# EAGLE design 15321^1 (EAGLE 7.6.0)
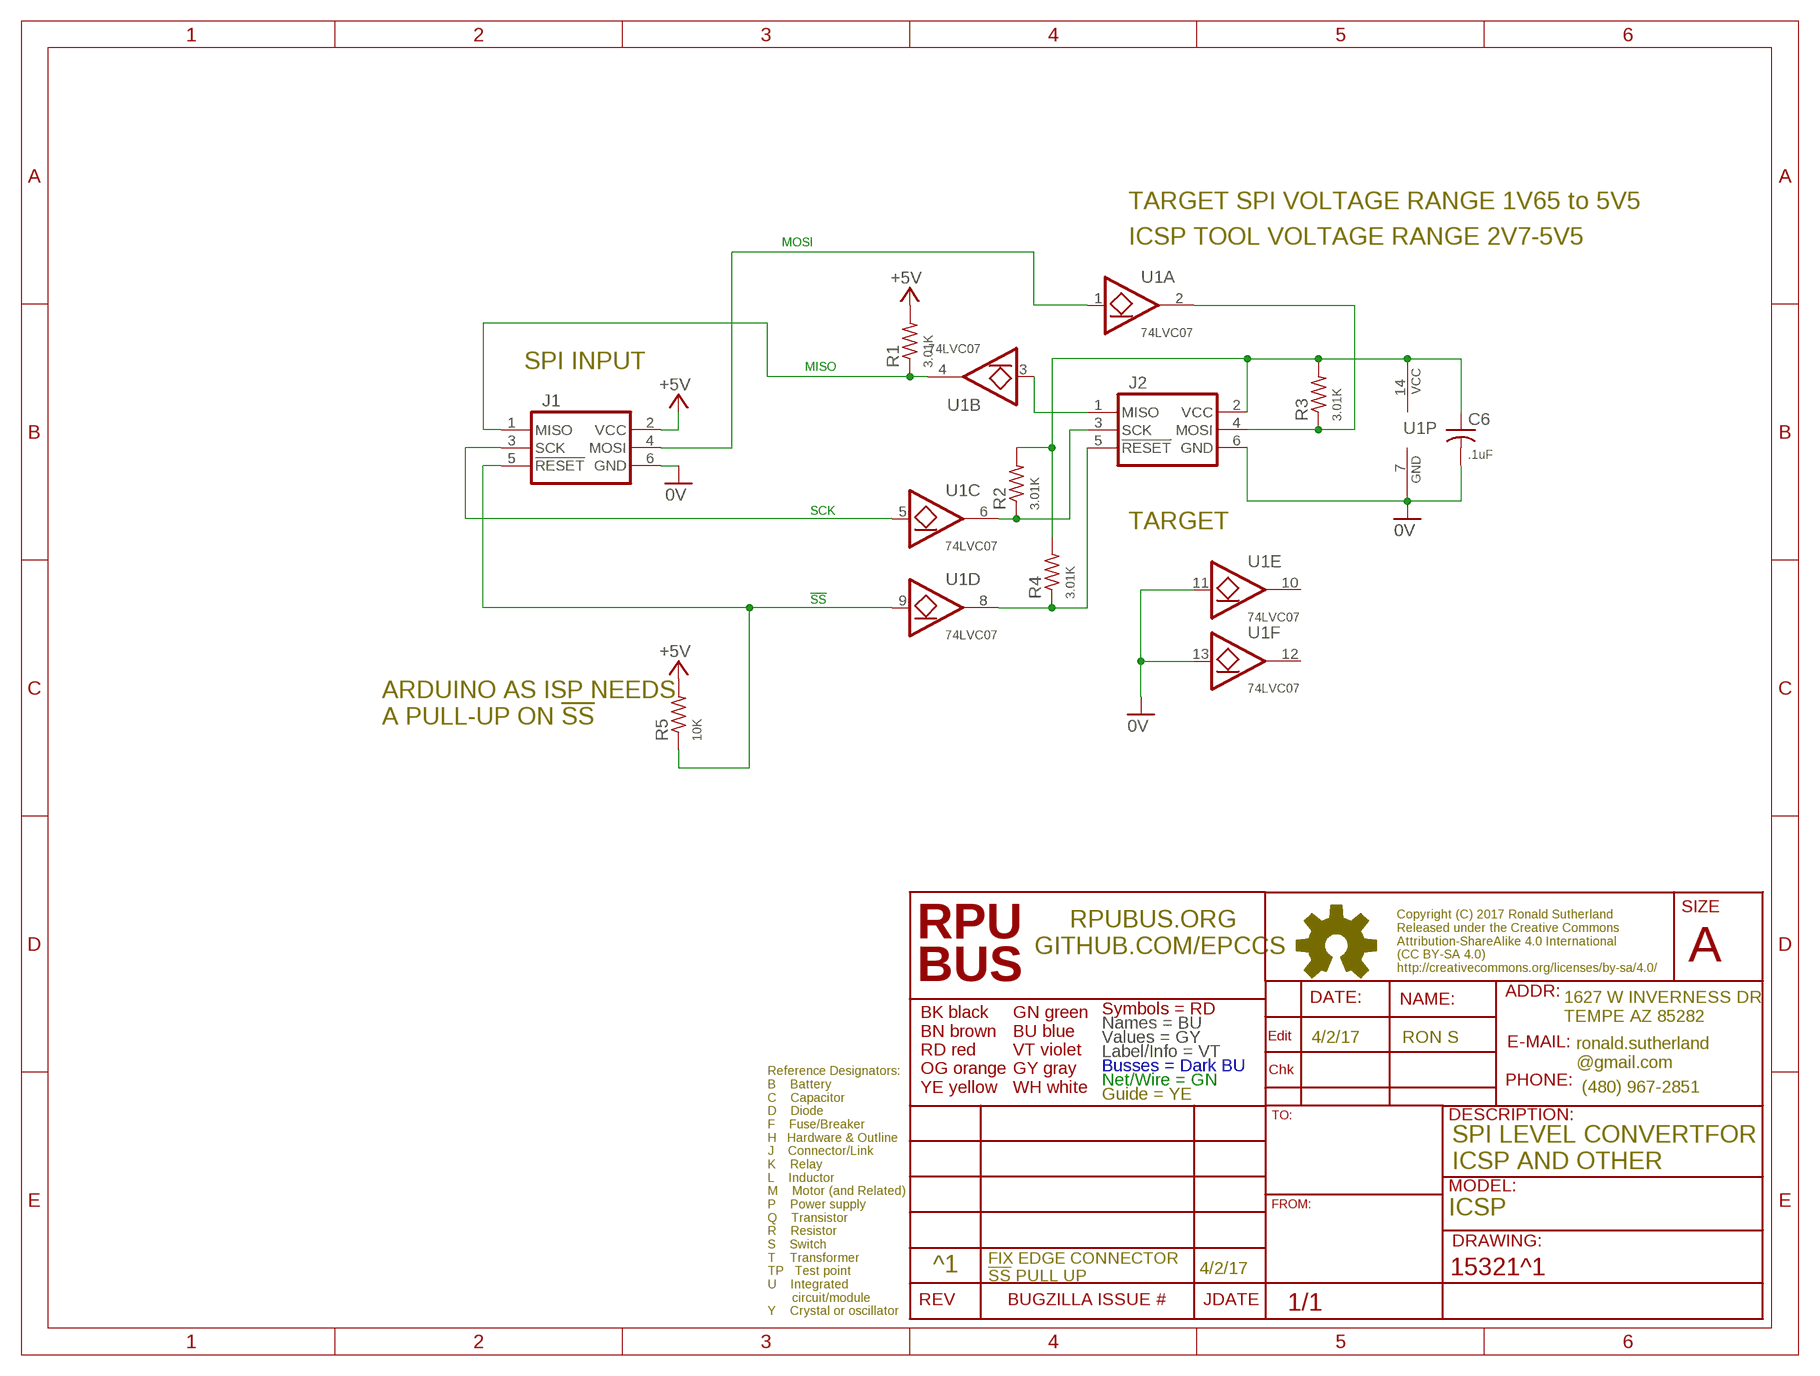
[diagram p0: schematic, sheet 1]

## Parts
C6  .1uF  CC0603A  [C0603(1608)]
J1  ISP-SPIEDG  [ISP-EDG]
J2  ISP-SPIEDG  [ISP-EDG]
R1  3.01K  R0805  [C0805(2012)]
R2  3.01K  R0805  [C0805(2012)]
R3  3.01K  R0805  [C0805(2012)]
R4  3.01K  R0805  [C0805(2012)]
R5  10K  R0805  [C0805(2012)]
U1  74LVC07  7407D  [14SOIC]

## Nets
0V: C6.2 J1.6(GND) J2.6(GND) U1.7(P:GND) U1.11(E:I) U1.13(F:I)
!SS: J1.5(!RESET) R5.1 U1.9(D:I)
+5V: J1.2(VCC) R1.2 R5.2
MISO: J1.1(MISO) R1.1 U1.4(B:O)
MOSI: J1.4(MOSI) U1.1(A:I)
N$1: J2.3(SCK) R2.1 U1.6(C:O)
N$3: J2.1(MISO) U1.3(B:I)
N$4: J2.4(MOSI) R3.1 U1.2(A:O)
N$5: J2.5(!RESET) R4.1 U1.8(D:O)
SCK: J1.3(SCK) U1.5(C:I)
VCC: C6.1 J2.2(VCC) R2.2 R3.2 R4.2 U1.14(P:VCC)
Unconnected: U1.10(E:O) U1.12(F:O)

## Notes on the sheet
- TARGET SPI VOLTAGE RANGE 1V65 to 5V5
- ICSP TOOL VOLTAGE RANGE 2V7-5V5
- SPI INPUT
- TARGET
- ARDUINO AS ISP NEEDS
  A PULL-UP ON !SS!
- 4/2/17 | RON S
- SPI LEVEL CONVERTFOR
  ICSP AND OTHER
- ICSP
- ^1 | 4/2/17
- FIX EDGE CONNECTOR
  !SS! PULL UP

## Library data of the parts
C6 = C-C:C: CAPACITOR Symbol
J1 J2 = U-AVR:ISP-SPI: AVR ISP thru SPI In-System Programming uses the target Atmel AVR’s internal SPI (Serial Peripheral Interface) to download code into the flash and EEPROM memories. It is not a debugging interface. When designing an application PCB which includes an AVR with the SPI interface, this pinout should be used. Sparkfun SKU: BOB-08508
R1-R5 = R-C:R: Resiistor American-style symbol
U1 = U-7400:74*07: HEX BUFFER, OPEN DRAIN/COLLECTOR 74LVC07A [DIODES,74LVC07AS14-13] LOGIC BUFFER OPEN DRAIN 14SOIC

## Net classes
0 default: width 0.254 mm, drill 0.356 mm

## Board
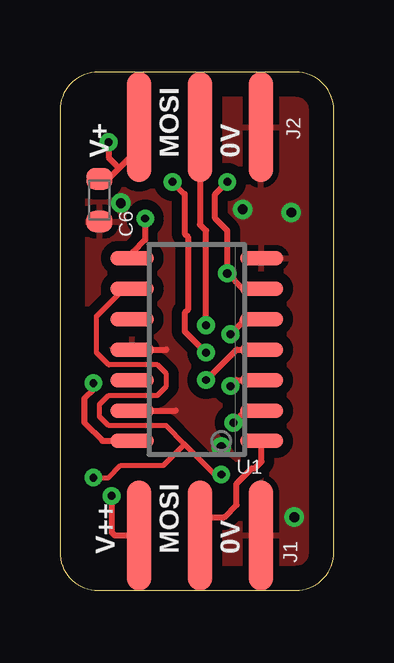
[diagram p1: board, top side]
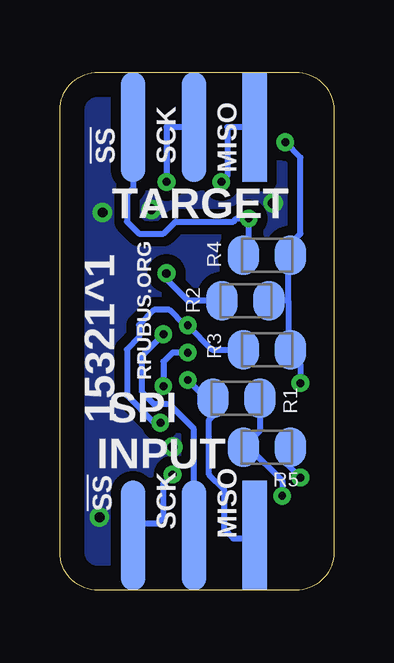
[diagram p2: board, bottom side, seen from below]

Size 11.43 x 21.59 mm. Coordinates in mm from the lower left corner, seen from the top.
Outline: 0,20 0,1.59 arc90 1.59,0 9.84,0 arc90 11.43,1.59 11.43,20 arc90 9.84,21.59 1.59,21.59 arc90 0,20
Copper layers (1*16): Top 0.035mm / dielectric 1.5mm / Bottom 0.035mm
Design rules "default *": minimum track width 10mil, minimum drill 13mil, track to track 10mil, track to pad 10mil, pad to pad 10mil, via to via 10mil, smd to smd 8mil, copper to edge 40mil, drill to drill 8mil, minimum pad ring 10mil, minimum via ring 8mil, stop-mask expansion 4mil, vias tented up to drill 17mil, thermal gap 10mil

### Footprints (pad centres in the part's own frame; a part is rotated, then mirrored left to right if it is on the bottom)
C0603(1608) = smd 0.898 x 1.1: 1 -0.889,0; 2 0.889,0
ISP-EDG = smd 1.016 x 4.572 bottom: 1 -2.54,2.286; 3 0,2.286; 5 2.54,2.286 | smd 1.016 x 4.572: 2 -2.54,2.286; 4 0,2.286; 6 2.54,2.286
C0805(2012) = smd 1.321 x 1.651: 1 -0.977,0; 2 0.977,0
14SOIC = smd 0.6 x 1.8: 1 -3.81,-2.7; 2 -2.54,-2.7; 3 -1.27,-2.7; 4 0,-2.7; 5 1.27,-2.7; 6 2.54,-2.7; 7 3.81,-2.7; 8 3.81,2.7; 9 2.54,2.7; 10 1.27,2.7; 11 0,2.7; 12 -1.27,2.7; 13 -2.54,2.7; 14 -3.81,2.7

### Placement (x,y rotation side)
C6  1.65,16.26 270 top
J1  5.84,0 0 top
J2  5.84,17.02 0 top
R1  4.06,8 0 bottom
R2  3.68,12.06 0 bottom
R3  2.79,10.03 0 bottom
R4  2.79,13.97 0 bottom
R5  2.79,5.97 180 bottom
U1  5.71,10.03 90 top

### Tracks (layer width: path | path; a pad name or v marks a point on that pad's centre or on a via)
0V  (via drill 0.41)
  Top 0.254: U1.13 4.83,7.49 | U1.11 4.45,10.03
  other vias: 7.62,15.88 2.54,16.13 9.65,15.75 9.78,3.05 6.73,5.97
  pour Bottom (isolate 0.406): 0,21.59 11.43,21.59 11.43,0 0,0
  pour Top (isolate 0.406): 0,21.59 11.43,21.59 11.43,0 0,0
!SS  (via drill 0.33)
  Top 0.203: U1.9 2.67,12.57 1.52,11.43 1.52,9.91 2.03,9.4 4.06,9.4 4.45,9.02 4.45,8.51 4.06,8.13 2.03,8.13 1.65,7.75 1.65,7.24 2.03,6.86 4.45,6.86 5.21,6.1 | v6.73,4.83 6.48,4.83 5.21,6.1 | v1.4,4.7 2.03,4.7 2.54,5.21 4.32,5.21 5.21,6.1
  Bottom 0.254: v6.73,4.83 7.11,4.45 7.11,3.05 7.37,2.79 8.38,2.79 J1.5 | R5.1 1.94,5.25 v1.4,4.7
+5V  (via drill 0.33)
  Top 0.254: 3.3,2.54 J1.2 2.29,2.29 2.16,2.41 v2.16,3.94
  Bottom 0.254: R1.2 3.09,6.65 R5.2 3.56,5.97 2.16,4.57 v2.16,3.94
MISO  (via drill 0.33)
  Top 0.254: U1.4 7.37,10.03 v6.1,8.76
  Bottom 0.254: J1.1 3.68,2.29 3.68,2.16 4.19,2.16 4.57,2.54 4.57,4.19 5.21,4.83 5.21,7.11 5.04,7.28 R1.1 5.29,7.96 v6.1,8.76
MOSI
  Top 0.254: J1.4 5.84,3.05 6.86,3.05 7.37,3.56 7.37,4.45 8,5.08 8.13,5.08 8.41,5.37 U1.1
N$1  (via drill 0.33, 0.36)
  Top 0.254: U1.6 7.62,12.57 v6.99,13.21 6.99,14.99 6.48,15.49 6.48,16.51 v6.99,17.02
  Bottom 0.254: v6.99,17.02 6.99,19.3 J2.3 | 4.57,11.94 R2.1 6.1,12.06 6.99,12.95 v6.99,13.21
N$3  (via drill 0.33)
  Top 0.254: U1.3 7.37,8.76 v7.11,8.51 | v6.1,9.91 5.21,10.79 5.21,11.56 5.33,11.68 5.33,14.73 5.21,14.86 5.21,16.51 v4.7,17.02
  Bottom 0.254: v6.1,9.91 6.73,9.91 7.11,9.53 v7.11,8.51 | v4.7,17.02 4.45,17.27 4.45,19.3 J2.1
N$4  (via drill 0.33)
  Top 0.254: J2.4 5.84,15.24 6.1,14.99 v6.1,11.05 | 8.89,7.49 U1.2 7.75,7.49 v7.24,6.99
  Bottom 0.254: R3.1 5.08,10.03 v6.1,11.05 6.22,11.05 6.86,11.68 7.49,11.68 8.13,11.05 8.13,10.54 8.64,10.03 8.64,8.13 7.49,6.99 v7.24,6.99
N$5  (via drill 0.33)
  Top 0.254: v3.56,15.49 3.56,14.61 3.05,14.1 3.05,13.84 U1.8
  Bottom 0.254: J2.5 8.38,16.76 8.64,16.51 8.64,15.37 8.13,14.86 7.11,14.86 6.6,15.37 4.19,15.37 4.06,15.49 v3.56,15.49 3.56,14.19 R4.1 3.81,13.97
SCK  (via drill 0.33)
  Top 0.254: U1.5 7.62,11.3 7.62,11.18 v7.11,10.67
  Bottom 0.254: v7.11,10.67 8,9.78 8,8.26 7.49,7.75 6.86,7.75 5.84,6.73 J1.3
VCC  (via drill 0.33)
  Top 0.254: 2.48,17.59 3.3,18.41 J2.2 | 2.48,17.59 2.03,17.14 C6.1 | v1.4,8.64 1.4,8.38 1.02,8 1.02,6.99 1.78,6.22 U1.14 | 2.48,17.59 2.03,18.03 v2.03,18.67
  Bottom 0.254: 1.91,12.06 1.91,9.91 | 1.91,12.06 1.91,13.97 | 1.91,12.06 R2.2 | 1.91,9.91 1.78,9.78 1.4,9.4 v1.4,8.64 | 1.91,9.91 R3.2 | 1.91,13.97 R4.2 | 1.91,13.97 1.91,14.35 1.4,14.86 1.4,18.03 v2.03,18.67

### Text on the board
tPlace: V+ | MOSI | 0V | V++ | MOSI | 0V
bPlace: SCK | !SS! | MISO | TARGET | RPUBUS.ORG | 15321^1 | SPI / INPUT | SCK | !SS! | MISO